# Altium schematic sheet 07-DPLL-1.SchDoc
size B; SheetNumber: 7; SheetTotal: 20
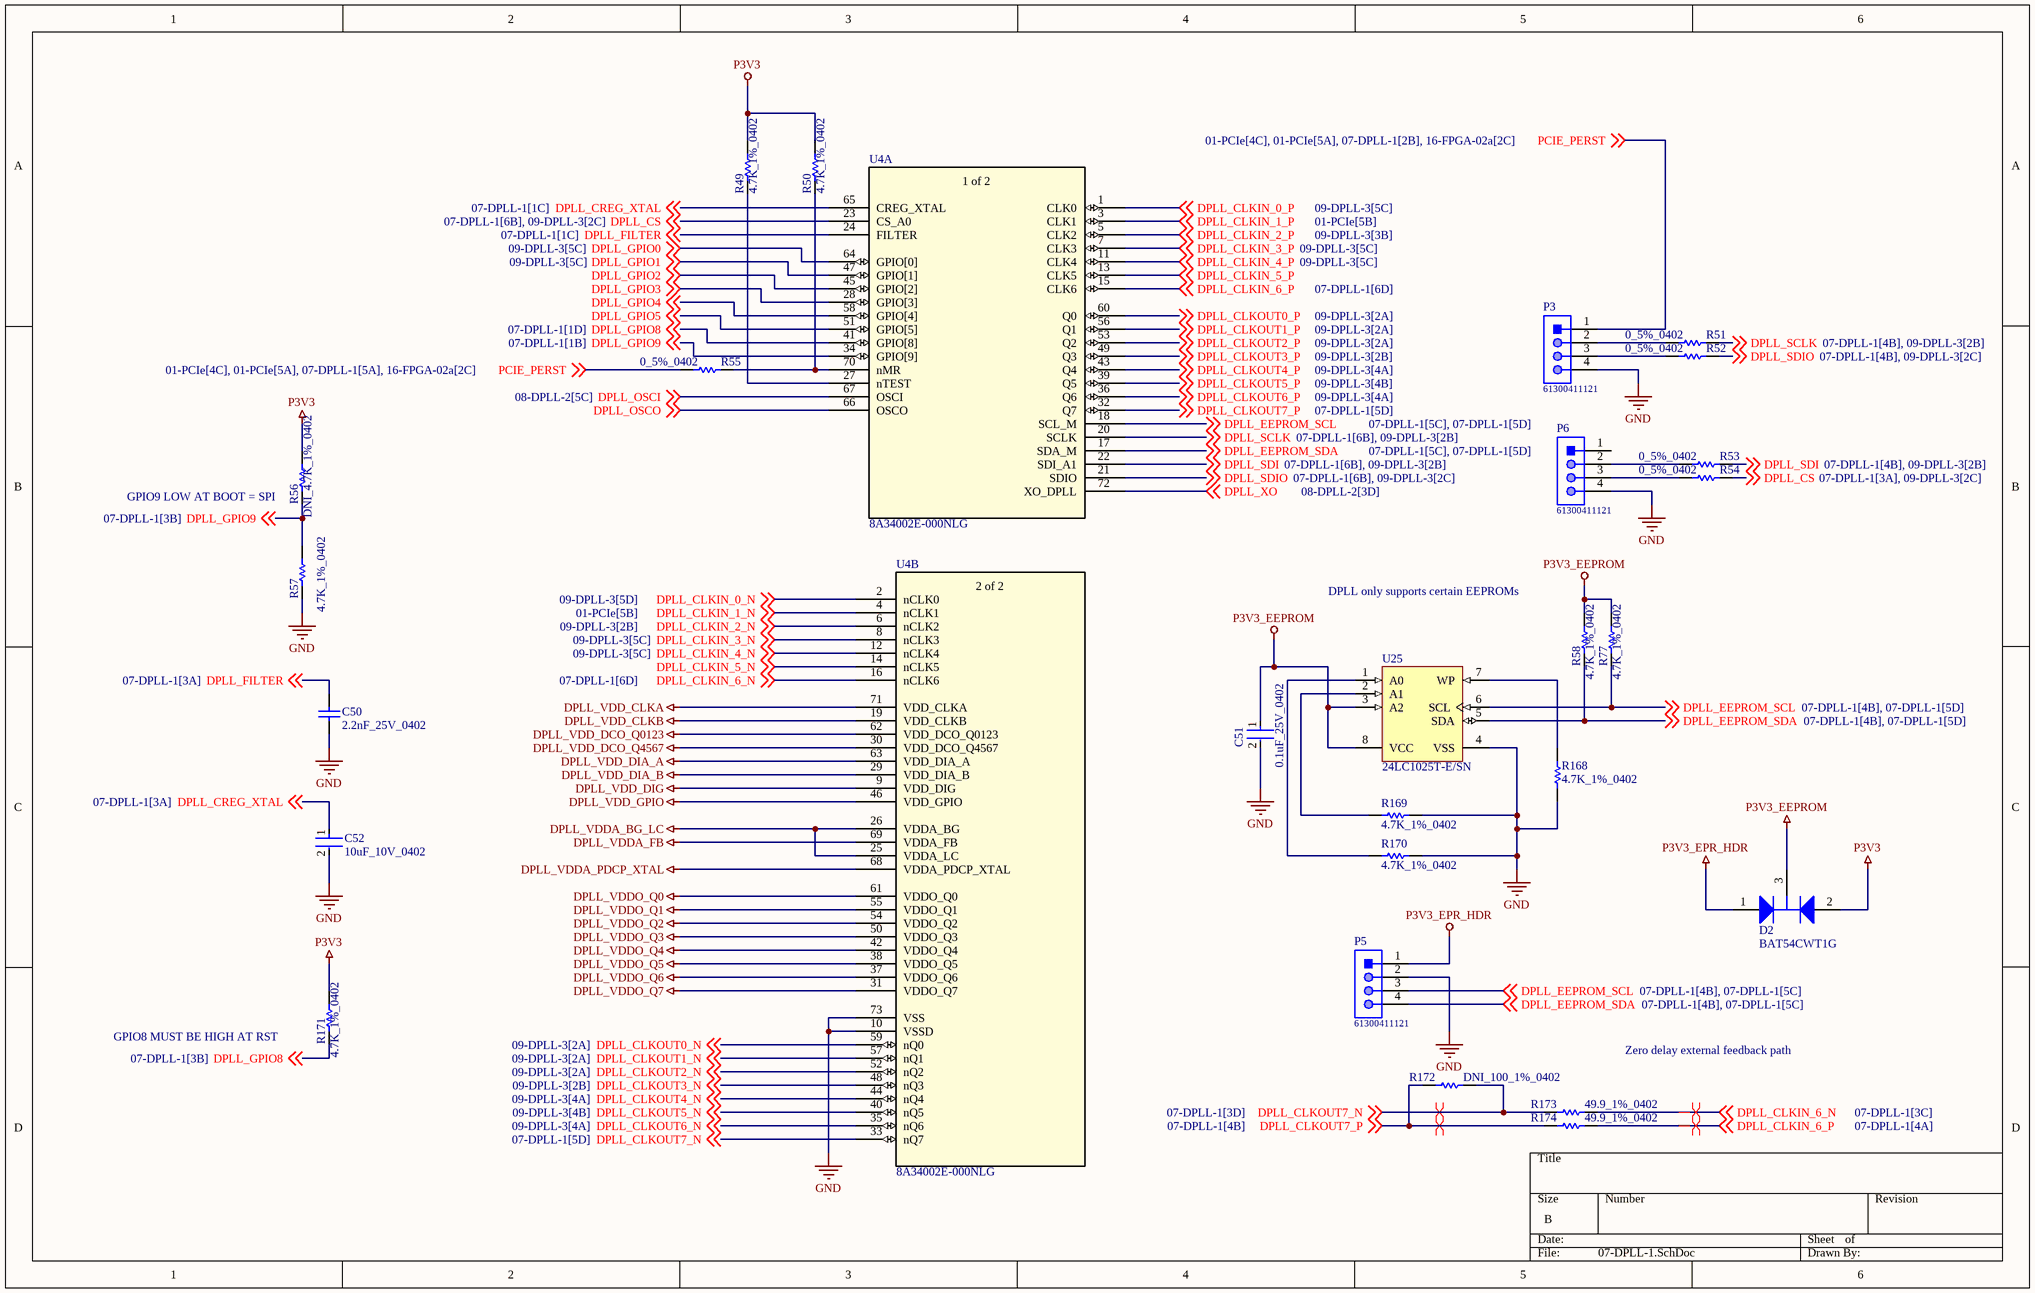
[diagram p0: 07-DPLL-1.SchDoc]

## Parts
C50  2.2nF_25V_0402  [CAPC1005X56X25LL10T15]
C51  0.1uF_25V_0402  [FP-0402-L_1_0_1-W_0_5_0_1-IPC_C]
C52  10uF_10V_0402  [FP-CL05A106MP5NUNC-MFG]
D2  BAT54CWT1G  [ONSC-SOT-323-3-419-04_V]
P3  61300411121  [61300411121]
P5  61300411121  [61300411121]
P6  61300411121  [61300411121]
R49  4.7K_1%_0402  [RESC1005X40X25NL10T10]
R50  4.7K_1%_0402  [RESC1005X40X25NL10T10]
R51  0_5%_0402  [RESC1005X40X25LL10T10]
R52  0_5%_0402  [RESC1005X40X25LL10T10]
R53  0_5%_0402  [RESC1005X40X25LL10T10]
R54  0_5%_0402  [RESC1005X40X25LL10T10]
R55  0_5%_0402  [RESC1005X40X25LL10T10]
R56  DNI_4.7K_1%_0402  [RESC1005X40X25NL10T10]  (no BOM)
R57  4.7K_1%_0402  [RESC1005X40X25NL10T10]
R58  4.7K_1%_0402  [RESC1005X40X25NL10T10]
R77  4.7K_1%_0402  [RESC1005X40X25NL10T10]
R168  4.7K_1%_0402  [RESC1005X40X25NL10T10]
R169  4.7K_1%_0402  [RESC1005X40X25NL10T10]
R170  4.7K_1%_0402  [RESC1005X40X25NL10T10]
R171  4.7K_1%_0402  [RESC1005X40X25NL10T10]
R172  DNI_100_1%_0402  [RESC1005X40X25LL05T05]  (no BOM)
R173  49.9_1%_0402  [RESC1005X40X25NL10T10]
R174  49.9_1%_0402  [RESC1005X40X25NL10T10]
U4  8A34002E-000NLG  [QFN_2E-000NLG_REN]  (parts A,B of 2)
U25  24LC1025T-E/SN  [SOIC-SN8_M]

## Nets
DPLL_VDD_CLKA: U4.71(VDD_CLKA)
DPLL_VDD_CLKB: U4.19(VDD_CLKB)
DPLL_VDD_DCO_Q0123: U4.62(VDD_DCO_Q0123)
DPLL_VDD_DCO_Q4567: U4.30(VDD_DCO_Q4567)
DPLL_VDD_DIA_A: U4.63(VDD_DIA_A)
DPLL_VDD_DIA_B: U4.29(VDD_DIA_B)
DPLL_VDD_DIG: U4.9(VDD_DIG)
DPLL_VDD_GPIO: U4.46(VDD_GPIO)
DPLL_VDDA_BG_LC: U4.25(VDDA_LC) U4.26(VDDA_BG)
DPLL_VDDA_FB: U4.69(VDDA_FB)
DPLL_VDDA_PDCP_XTAL: U4.68(VDDA_PDCP_XTAL)
DPLL_VDDO_Q0: U4.61(VDDO_Q0)
DPLL_VDDO_Q1: U4.55(VDDO_Q1)
DPLL_VDDO_Q2: U4.54(VDDO_Q2)
DPLL_VDDO_Q3: U4.50(VDDO_Q3)
DPLL_VDDO_Q4: U4.42(VDDO_Q4)
DPLL_VDDO_Q5: U4.38(VDDO_Q5)
DPLL_VDDO_Q6: U4.37(VDDO_Q6)
DPLL_VDDO_Q7: U4.31(VDDO_Q7)
GND: C50.1 C51.2 C52.2 P3.4 P5.2 P6.4 R57.1 R168.2 R169.1 R170.2 U4.10(VSSD) U4.73(VSS) U25.4(VSS)
P3V3: D2.2(A2) R49.2 R50.2 R56.1 R171.1
P3V3_EEPROM: C51.1 D2.3(K) R58.1 R77.1 U25.3(A2) U25.8(VCC)
P3V3_EPR_HDR: D2.1(A1) P5.1
DPLL_CLKIN_0_N: U4.2(nCLK0) ; off-sheet DPLL_CLKIN_0_N
DPLL_CLKIN_0_P: U4.1(CLK0) ; off-sheet DPLL_CLKIN_0_P
DPLL_CLKIN_1_N: U4.4(nCLK1) ; off-sheet DPLL_CLKIN_1_N
DPLL_CLKIN_1_P: U4.3(CLK1) ; off-sheet DPLL_CLKIN_1_P
DPLL_CLKIN_2_N: U4.6(nCLK2) ; off-sheet DPLL_CLKIN_2_N
DPLL_CLKIN_2_P: U4.5(CLK2) ; off-sheet DPLL_CLKIN_2_P
DPLL_CLKIN_3_N: U4.8(nCLK3) ; off-sheet DPLL_CLKIN_3_N
DPLL_CLKIN_3_P: U4.7(CLK3) ; off-sheet DPLL_CLKIN_3_P
DPLL_CLKIN_4_N: U4.12(nCLK4) ; off-sheet DPLL_CLKIN_4_N
DPLL_CLKIN_4_P: U4.11(CLK4) ; off-sheet DPLL_CLKIN_4_P
DPLL_CLKIN_5_N: U4.14(nCLK5) ; off-sheet DPLL_CLKIN_5_N
DPLL_CLKIN_5_P: U4.13(CLK5) ; off-sheet DPLL_CLKIN_5_P
DPLL_CLKIN_6_N: R173.2 U4.16(nCLK6) ; off-sheet DPLL_CLKIN_6_N
DPLL_CLKIN_6_P: R174.2 U4.15(CLK6) ; off-sheet DPLL_CLKIN_6_P
DPLL_CLKOUT0_N: U4.59(nQ0) ; off-sheet DPLL_CLKOUT0_N
DPLL_CLKOUT0_P: U4.60(Q0) ; off-sheet DPLL_CLKOUT0_P
DPLL_CLKOUT1_N: U4.57(nQ1) ; off-sheet DPLL_CLKOUT1_N
DPLL_CLKOUT1_P: U4.56(Q1) ; off-sheet DPLL_CLKOUT1_P
DPLL_CLKOUT2_N: U4.52(nQ2) ; off-sheet DPLL_CLKOUT2_N
DPLL_CLKOUT2_P: U4.53(Q2) ; off-sheet DPLL_CLKOUT2_P
DPLL_CLKOUT3_N: U4.48(nQ3) ; off-sheet DPLL_CLKOUT3_N
DPLL_CLKOUT3_P: U4.49(Q3) ; off-sheet DPLL_CLKOUT3_P
DPLL_CLKOUT4_N: U4.44(nQ4) ; off-sheet DPLL_CLKOUT4_N
DPLL_CLKOUT4_P: U4.43(Q4) ; off-sheet DPLL_CLKOUT4_P
DPLL_CLKOUT5_N: U4.40(nQ5) ; off-sheet DPLL_CLKOUT5_N
DPLL_CLKOUT5_P: U4.39(Q5) ; off-sheet DPLL_CLKOUT5_P
DPLL_CLKOUT6_N: U4.35(nQ6) ; off-sheet DPLL_CLKOUT6_N
DPLL_CLKOUT6_P: U4.36(Q6) ; off-sheet DPLL_CLKOUT6_P
DPLL_CLKOUT7_N: R172.2 R173.1 U4.33(nQ7) ; off-sheet DPLL_CLKOUT7_N
DPLL_CLKOUT7_P: R172.1 R174.1 U4.32(Q7) ; off-sheet DPLL_CLKOUT7_P
DPLL_CREG_XTAL: C52.1 U4.65(CREG_XTAL) ; off-sheet DPLL_CREG_XTAL
DPLL_CS: R54.2 U4.23(CS_A0) ; off-sheet DPLL_CS
DPLL_EEPROM_SCL: P5.3 R77.2 U4.18(SCL_M) U25.6(SCL) ; off-sheet DPLL_EEPROM_SCL
DPLL_EEPROM_SDA: P5.4 R58.2 U4.17(SDA_M) U25.5(SDA) ; off-sheet DPLL_EEPROM_SDA
DPLL_FILTER: C50.2 U4.24(FILTER) ; off-sheet DPLL_FILTER
DPLL_GPIO0: U4.64(GPIO[0]) ; off-sheet DPLL_GPIO0
DPLL_GPIO1: U4.47(GPIO[1]) ; off-sheet DPLL_GPIO1
DPLL_GPIO2: U4.45(GPIO[2]) ; off-sheet DPLL_GPIO2
DPLL_GPIO3: U4.28(GPIO[3]) ; off-sheet DPLL_GPIO3
DPLL_GPIO4: U4.58(GPIO[4]) ; off-sheet DPLL_GPIO4
DPLL_GPIO5: U4.51(GPIO[5]) ; off-sheet DPLL_GPIO5
DPLL_GPIO8: R171.2 U4.41(GPIO[8]) ; off-sheet DPLL_GPIO8
DPLL_GPIO9: R56.2 R57.2 U4.34(GPIO[9]) ; off-sheet DPLL_GPIO9
DPLL_OSCI: U4.67(OSCI) ; off-sheet DPLL_OSCI
DPLL_OSCO: U4.66(OSCO) ; off-sheet DPLL_OSCO
DPLL_SCLK: R51.2 U4.20(SCLK) ; off-sheet DPLL_SCLK
DPLL_SDI: R53.2 U4.22(SDI_A1) ; off-sheet DPLL_SDI
DPLL_SDIO: R52.2 U4.21(SDIO) ; off-sheet DPLL_SDIO
DPLL_XO: U4.72(XO_DPLL) ; off-sheet DPLL_XO
PCIE_PERST: P3.1 R55.1 ; off-sheet PCIE_PERST
NetP3_2: P3.2 R51.1
NetP3_3: P3.3 R52.1
NetP6_2: P6.2 R53.1
NetP6_3: P6.3 R54.1
NetR49_1: R49.1 U4.27(nTEST)
NetR50_1: R50.1 R55.2 U4.70(nMR)
NetR168_1: R168.1 U25.7(WP)
NetR169_2: R169.2 U25.2(A1)
NetR170_1: R170.1 U25.1(A0)

Not connected (* = marked no-connect by the designer): P6 1

## Layout directives
differential pair: DPLL_CLKIN_6_N, DPLL_CLKIN_6_P, DPLL_CLKOUT7_N, DPLL_CLKOUT7_P

## Notes on the sheet
- (near R56) GPIO9 LOW AT BOOT = SPI
- DPLL only supports certain EEPROMs
- GPIO8 MUST BE HIGH AT RST
- Zero delay external feedback path
- (in symbol 8A34002E-000NLG, part A) 1 of 2
- (in symbol 8A34002E-000NLG, part B) 2 of 2

## Library data of the parts
C50 = CMP-2008-02907-1: Manufacturer: AVX Interconnect / Elco; Part Number: 04025C222JAT2A
C51 = CMP-2008-02519-2: General Purpose Ceramic Capacitor, 0402, 100nF, 10%, X7R, 15%, 25V; Package Quantity: 1; Capacitance: 100nF; Min Operating Temperature: -55°C; Voltage: 25V; Voltage Rating: 25V; Construction: Flat; Max Operating Temperature: 125°C; Radiation Hardening: No; Depth: 0.5mm; Thickness: 0.022inch; Voltage Rating (DC): 25V; Number of Pins: 2; Lead Free: Lead Free; Series: -; REACH SVHC: No SVHC; Length: 1mm; Dielectric: X7R; RoHS Compliant: Yes; Mount: Surface Mount; Packaging: Tape and Reel; Case/Package: 0402; Case Code (Imperial): 0402; Termination: SMD/SMT; Width: 0.02inch; Case Code (Metric): 1005; Tolerance: 10%
C52 = CMP-13271-000002-1: CAP CER 10UF 10V X5R 0402; Manufacturer Part Number: CL05A106MP5NUNC; Manufacturer: Samsung; Temperature Coefficient: 15%; Tolerance: 20%; Material: Ceramic; Octopart: https://octopart.com/cl05a106mp5nunc-samsung-22457395; Voltage Rating: 10V; RoHS: TRUE; Value: 10uF; Height: 0.7mm; Digikey Description: CAP CER 10UF 10V X5R 0402; Automotive: No; Package: CL05A106MP5NUNC; Device Class L1: Passive Components; Capacitance: 10uF; Temperature Range High: +85°C; ComponentLink2Description: Datasheet; Device Class L2: Capacitors; Temperature Characteristic: X5R; Temperature: -55°C to +85°C; ComponentLink2URL: http://www.samsungsem.com/kr/support/product-search/mlcc/__icsFiles/afieldfile/2019/05/10/19-CL05A106MP5NUNC.pdf; Device Class L3: Ceramic Capacitors; Category: Cap; Temperature Range Low: -55°C; Ipc Land Pattern Name: CAPC10050X50; Lead Free: Yes
D2 = CMP-1055-00557-1: Dual Series Cathode Schottky Barrier Diodes, 3-Pin SOT-323, Pb-Free, Tape and Reel; Manufacturer: On Semiconductor; Configuration: Common Cathode; IFSM Max (A): 0.6; trr Max (ns): 5; ComponentLink2Description: Datasheet; Packing: Tape and Reel; ComponentLink3Description: Package Specification; Mounting Technology: Surface Mount; PartNumber: BAT54CWT1G; PackageVersion: Rev. N, 11/2008; RoHS: TRUE; ComponentLink3URL: http://www.onsemi.com/pub_link/Collateral/419-04.PDF; ComponentLink2URL: http://www.onsemi.cn/pub_link/Collateral/BAT54CWT1-D.PDF; PackageReference: SOT-323-3-419-04; ComponentLink1URL: http://www.onsemi.com/; ComponentLink1Description: Manufacturer URL; DatasheetVersion: Rev. 7; PackageDescription: 3-Pin Small Outline Transistor, Body 2 x 1.25 mm, Pitch 0.65 mm
P3 P5 P6 = CMP-1502-01064-1: THT Vertical Pin Header WR-PHD, Pitch 2.54 mm, Single Row, 4 pins; Manufacturer: Wurth Elektronik; Withstanding Voltage: 500VAC; Rated Current: 3A; Working Voltage: 250VAC; Pin Number: 4; Gender: Male; Contact Resistance: 20mOhm; Pitch: 2.54mm; Manufacturer URL: http://www.we-online.de; Operating Temperature: -40to105degC; Packaging: Bag; Mounting Technology: THT; Package Reference: 61300411121; Datasheet URL: https://katalog.we-online.de/em/datasheet/6130xx11121.pdf; Publisher: WurthElektronik; Part Number: 61300411121; Row Number: Single; Orientation: Vertical
R49 R50 R56-R58 R77 R168-R171 = CMP-2002-05217-1: Manufacturer: Bourns; Part Number: CR0402-FX-4701GLF
R51-R55 = CMP-2002-04569-1: Manufacturer: KOA Speer; Part Number: RK73Z1ETTP
R172 = CMP-2002-00605-3: Chip Resistor, 100 Ohm, +/- 1%, 100 mW, -55 to 155 degC, 0402 (1005 Metric), RoHS, Tape and Reel; Manufacturer: Basic Passives; PartNumber: ERJ-2RKF1000X; Power Rating: 100 mW; Resistance: 100 Ohm; Voltage Rating: 50 V; Case\/Package: 0402; Width: 0.5 mm; Pins: 2; ComponentLink2Description: Datasheet; PackageReference: 0402; Height: 0.35 mm; Tolerance: 1%; DatasheetVersion: 04/2015; Case Code (Imperial): 0402; Min Operating Temperature: -55 degC; Radiation Hardening: No; Length: 1 mm; Package Quantity: 10000; PackageDescription: 2-Pin Surface Mount Device, Body 1 x 0.5 mm; Mounting Technology: Surface Mount; Case Code (Metric): 1005; Packaging: Tape and Reel; ComponentLink1URL: http://www.panasonic.com/; RoHSCompliant: true; Max Operating Temperature: 155 degC; REACH SVHC: Yes; ComponentLink1Description: Manufacturer URL; ComponentLink2URL: http://industrial.panasonic.com/cdbs/www-data/pdf/RDA0000/AOA0000C86.pdf; Mount: Surface Mount
R173 R174 = CMP-2002-04448-1: Part Number: RK73H1ETTP49R9F; Manufacturer: KOA Speer
U4 = 8A34002E-000NLG: No Description Available; Mfr_Name: Renesas Electronics; RefDes: RefDes; Type: Type
U25 = CMP-0159-00340-1: 1 Mbit, 400kHz, 2.5V, 8-Pin SOIC 150mil, Extended Temperature, Tape and Reel; Code_JEDEC: MS-012; PackageVersion: revBB, Aug-2009; PackageDescription: 8-Lead Plastic Small Outline (SN) - Narrow, 3.90mm Body [SOIC]; DatasheetVersion: revF, Oct-2008; PackageReference: SOIC-SN8; Code_IPC: SOIC127P600-8